# Altium schematic sheet Connectors.SchDoc
size A; SheetNumber: 3; SheetTotal: 5
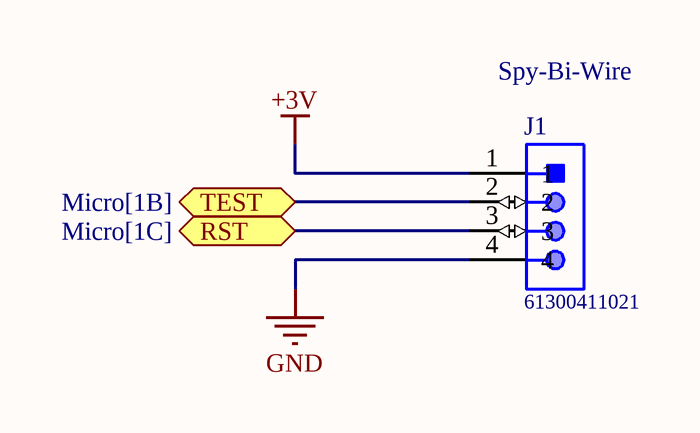
[diagram p0: Connectors.SchDoc]

## Parts
J1  61300411021  [61300411021]

## Ports
RST (bidir, see Micro[1C]), TEST (bidir, see Micro[1B])

## Nets
+3V: J1.1
GND: J1.4
RST: J1.3 ; port RST
TEST: J1.2 ; port TEST

## Notes on the sheet
- (near J1) Spy-Bi-Wire

## Library data of the parts
J1 = CMP-1502-01063-1: THT Angled Pin Header WR-PHD, Pitch 2.54 mm, Single Row, 4 pins; Manufacturer: Wurth Elektronik; Gender: Male; Pin Number: 4; Withstanding Voltage: 500VAC; Working Voltage: 250VAC; Contact Resistance: 20mOhm; Pitch: 2.54mm; Rated Current: 3A; Manufacturer URL: http://www.we-online.de; Mounting Technology: THT; Publisher: WurthElektronik; Operating Temperature: -40to105degC; Packaging: Bag; Row Number: Single; Package Reference: 61300411021; Part Number: 61300411021; Orientation: Angled; Datasheet URL: https://katalog.we-online.de/em/datasheet/6130xx11021.pdf